# Altium schematic sheet ForEK2.SchDoc
size A3; SheetNumber: 1; SheetTotal: 1
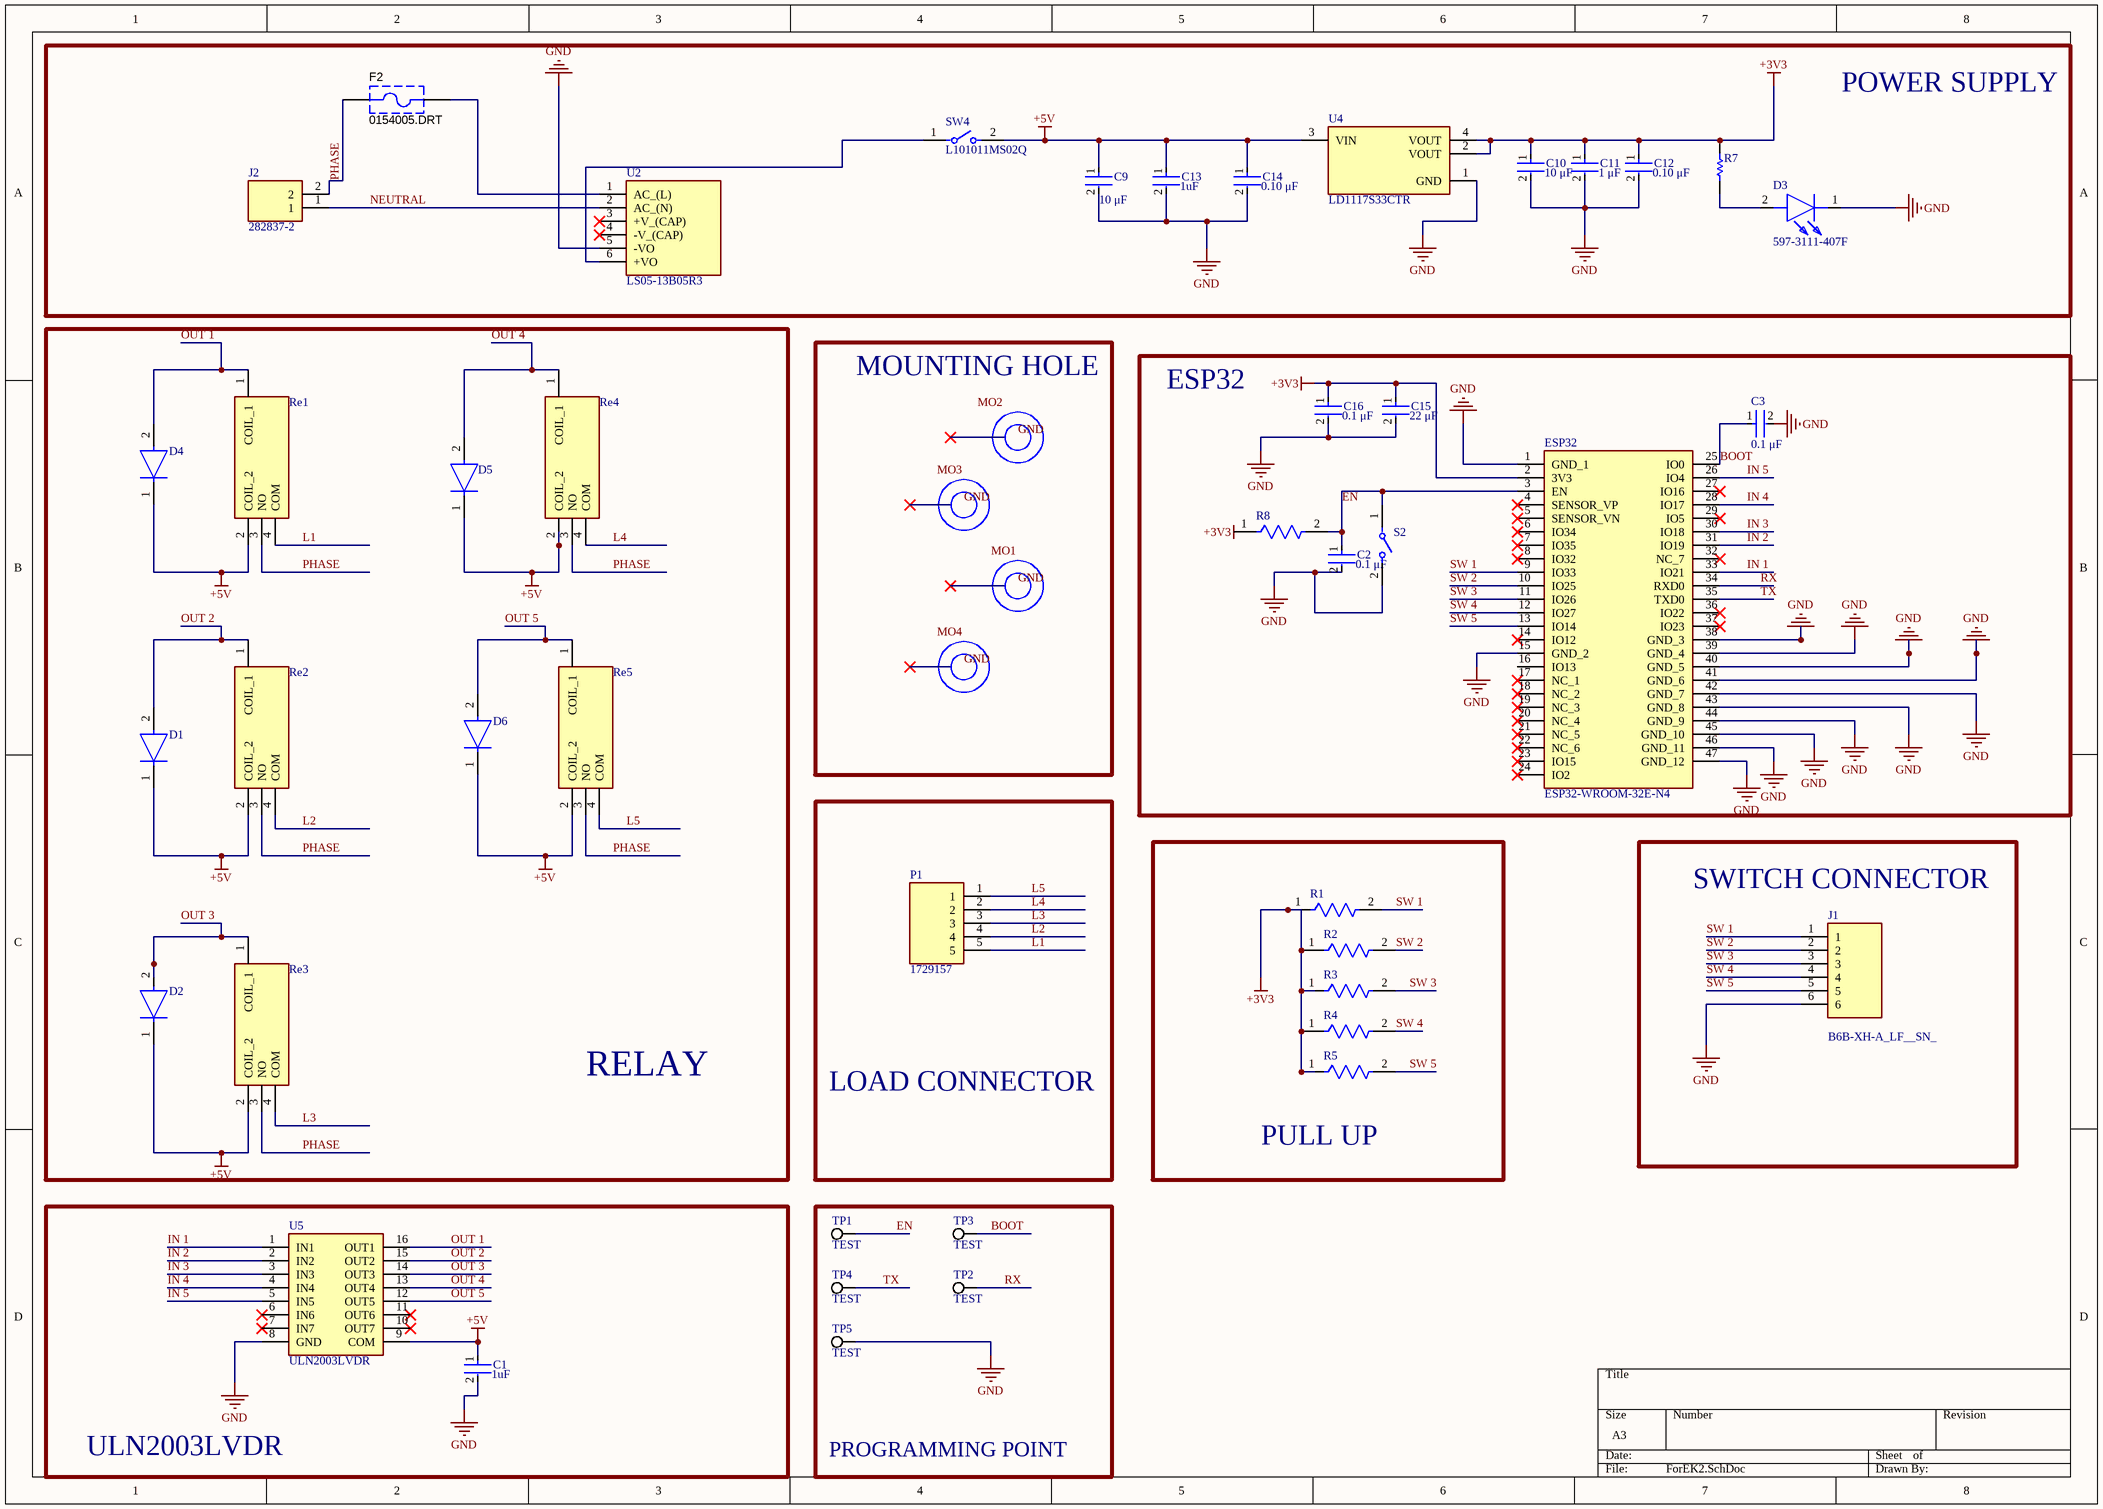
[diagram p0: ForEK2.SchDoc]

## Parts
C1  Capacitance: 1uF  [FP-C0402-BB-MFG]  (hidden comment: C0402C104K8PACTU)
C2  value 0.1 μF  [FP-C0402-BB-MFG]  (hidden comment: C0402C104K8PACTU)
C3  value 0.1 μF  [FP-C0402-BB-MFG]  (hidden comment: C0402C104K8PACTU)
C9  value 10 μF  [FP-C0402-BB-MFG]  (hidden comment: C0402C104K8PACTU)
C10  value 10 μF  [FP-C0402-BB-MFG]  (hidden comment: C0402C104K8PACTU)
C11  value 1 μF  [FP-C0402-BB-MFG]  (hidden comment: C0402C104K8PACTU)
C12  Capacitance: 0.10 μF  [FP-C0402-BB-MFG]  (hidden comment: C0402C104K8PACTU)
C13  Capacitance: 1uF  [FP-C0402-BB-MFG]  (hidden comment: C0402C104K8PACTU)
C14  value 0.10 μF  [FP-C0402-BB-MFG]  (hidden comment: C0402C104K8PACTU)
C15  value 22 μF  [FP-C0402-BB-MFG]  (hidden comment: C0402C104K8PACTU)
C16  value 0.1 μF  [FP-C0402-BB-MFG]  (hidden comment: C0402C104K8PACTU)
D1  1N4148  [FP-017AG-MFG]  (value not drawn)
D2  1N4148  [FP-017AG-MFG]  (value not drawn)
D3  597-3111-407F  [LEDC3015X150N]
D4  1N4148  [FP-017AG-MFG]  (value not drawn)
D5  1N4148  [FP-017AG-MFG]  (value not drawn)
D6  1N4148  [FP-017AG-MFG]  (value not drawn)
ESP32  ESP32-WROOM-32E-N4  [ESP32WROOM32EN4]
F2  0154005.DRT  [LFUS-154_V]
J1  B6B-XH-A_LF__SN_  [SHDR6W64P0X250_1X6_1740X575X700P]
J2  282837-2  [2828372]
P1  1729157  [1729157]
R1  CRCW040210K0JNED  [FP-CRCW0402-e3-IPC_B]  (value not drawn)
R2  CRCW040210K0JNED  [FP-CRCW0402-e3-IPC_B]  (value not drawn)
R3  CRCW040210K0JNED  [FP-CRCW0402-e3-IPC_B]  (value not drawn)
R4  CRCW040210K0JNED  [FP-CRCW0402-e3-IPC_B]  (value not drawn)
R5  CRCW040210K0JNED  [FP-CRCW0402-e3-IPC_B]  (value not drawn)
R7  ERJ-3EKF3300V  [RESC1608X55X30LL15T15]  (value not drawn)
R8  CRCW040210K0JNED  [FP-CRCW0402-e3-IPC_B]  (value not drawn)
Re1  HF46F-G_5-HS1T  [HF46FG5HS1T]  (value not drawn)
Re2  HF46F-G_5-HS1T  [HF46FG5HS1T]  (value not drawn)
Re3  HF46F-G_5-HS1T  [HF46FG5HS1T]  (value not drawn)
Re4  HF46F-G_5-HS1T  [HF46FG5HS1T]  (value not drawn)
Re5  HF46F-G_5-HS1T  [HF46FG5HS1T]  (value not drawn)
S2  L101011MS02Q  [FP-L101011MS02Q-MFG]  (value not drawn)
SW4  L101011MS02Q  [FP-L101011MS02Q-MFG]
TP1  TEST  [KSTN-5012_V]
TP2  TEST  [KSTN-5012_V]
TP3  TEST  [KSTN-5012_V]
TP4  TEST  [KSTN-5012_V]
TP5  TEST  [KSTN-5012_V]
U2  LS05-13B05R3  [LS0513B05R3]
U4  LD1117S33CTR  [FP-SOT-223-0046067_14-MFG]
U5  ULN2003LVDR  [SOIC127P600X175-16N]

## Blocks framed on the sheet
POWER SUPPLY: C9-C14 D3 F2 J2 R7 SW4 U2 U4
RELAY: D1 D2 D4-D6 Re1-Re5
ESP32: C2 C3 C15 C16 ESP32 R8 S2
LOAD CONNECTOR: P1
PULL UP: R1-R5
SWITCH CONNECTOR: J1
ULN2003LVDR: C1 U5
PROGRAMMING POINT: TP1-TP5

## Nets
+3V3: C10.1 C11.1 C12.1 C15.1 C16.1 ESP32.2(3V3) R1.1 R2.1 R3.1 R4.1 R5.1 R7.2 U4.2(VOUT) U4.4(VOUT)
+5V: C1.1 C9.1 C13.1 C14.1 D1.1(C) D2.1(C) D4.1(C) D5.1(C) D6.1(C) Re1.2(COIL_2) Re2.2(COIL_2) Re3.2(COIL_2) Re4.2(COIL_2) Re5.2(COIL_2) SW4.2 U4.3(VIN) U5.9(COM)
GND: C1.2 C2.2 C3.2 C9.2 C10.2 C11.2 C12.2 C13.2 C14.2 C15.2 C16.2 D3.1(K) ESP32.1(GND_1) ESP32.15(GND_2) ESP32.38(GND_3) ESP32.39(GND_4) ESP32.40(GND_5) ESP32.41(GND_6) ESP32.42(GND_7) ESP32.43(GND_8) ESP32.44(GND_9) ESP32.45(GND_10) ESP32.46(GND_11) ESP32.47(GND_12) J1.6 S2.2 TP5.1 U2.5(-VO) U4.1(GND) U5.8(GND)
BOOT: C3.1 ESP32.25(IO0) TP3.1
EN: C2.1 ESP32.3(EN) R8.2 S2.1 TP1.1
IN 1: ESP32.33(IO21) U5.1(IN1)
IN 2: ESP32.31(IO19) U5.2(IN2)
IN 3: ESP32.30(IO18) U5.3(IN3)
IN 4: ESP32.28(IO17) U5.4(IN4)
IN 5: ESP32.26(IO4) U5.5(IN5)
L1: P1.5 Re1.4(COM)
L2: P1.4 Re2.4(COM)
L3: P1.3 Re3.4(COM)
L4: P1.2 Re4.4(COM)
L5: P1.1 Re5.4(COM)
NEUTRAL: J2.1 U2.2(AC_(N))
OUT 1: D4.2(A) Re1.1(COIL_1) U5.16(OUT1)
OUT 2: D1.2(A) Re2.1(COIL_1) U5.15(OUT2)
OUT 3: D2.2(A) Re3.1(COIL_1) U5.14(OUT3)
OUT 4: D5.2(A) Re4.1(COIL_1) U5.13(OUT4)
OUT 5: D6.2(A) Re5.1(COIL_1) U5.12(OUT5)
PHASE: F2.1 J2.2 Re1.3(NO) Re2.3(NO) Re3.3(NO) Re4.3(NO) Re5.3(NO)
RX: ESP32.34(RXD0) TP2.1
SW 1: ESP32.9(IO33) J1.1 R1.2
SW 2: ESP32.10(IO25) J1.2 R2.2
SW 3: ESP32.11(IO26) J1.3 R3.2
SW 4: ESP32.12(IO27) J1.4 R4.2
SW 5: ESP32.13(IO14) J1.5 R5.2
TX: ESP32.35(TXD0) TP4.1
NetD3_2: D3.2(A) R7.1
NetF2_2: F2.2 U2.1(AC_(L))
NetSW4_1: SW4.1 U2.6(+VO)

Not connected (* = marked no-connect by the designer): ESP32 4(SENSOR_VP)* 5(SENSOR_VN)* 6(IO34)* 7(IO35)* 8(IO32)* 14(IO12)* 16(IO13) 17(NC_1)* 18(NC_2)* 19(NC_3)* 20(NC_4)* 21(NC_5)* 22(NC_6)* 23(IO15)* 24(IO2)* 27(IO16)* 29(IO5)* 32(NC_7)* 36(IO22)* 37(IO23)*; R8 1; U2 3(+V_(CAP))* 4(-V_(CAP))*; U5 6(IN6)* 7(IN7)* 10(OUT7)* 11(OUT6)*

## Notes on the sheet
- MOUNTING HOLE
- Labels drawn without touching a wire or pin: +3V3, GND, MO1, MO2, MO3, MO4

## Library data of the parts
C1 C13 = CMP-2008-02046-2: CAP CER 0.1UF 10V X5R 0402; Manufacturer: Kemet; Material: Ceramic; Temperature Coefficient: 15%; Tolerance: 0.1; Value: 1 μF; Package: C0402-BB; Temperature: -55°C to +125°C; ComponentLink2Description: Datasheet; Temperature Characteristic: X5R; Device Class L1: Passive Components; Height: 0.55mm; Lead Free: Yes; ComponentLink2URL: https://content.kemet.com/datasheets/KEM_C1002_X7R_SMD.pdf; Device Class L2: Capacitors; Temperature Range Low: -55°C; Temperature Range High: +125°C; RoHS: TRUE; Octopart: https://octopart.com/c0402c104k8pactu-kemet-140039; Automotive: No; Mouser Description: Capacitor 100 nF 10 VDC 0402; Category: Cap; Voltage Rating: 10 V; Digikey Description: CAP CER 0.1UF 10V X5R 0402; Ipc Land Pattern Name: CAPC10050X50; Device Class L3: Ceramic Capacitors; Manufacturer Part Number: C0402C104K8PACTU
C2 C3 C9-C11 C14-C16 = CMP-2008-02046-2: CAP CER 0.1UF 10V X5R 0402; Manufacturer: Kemet; Material: Ceramic; Temperature Coefficient: 15%; Tolerance: 0.1; Package: C0402-BB; Temperature: -55°C to +125°C; ComponentLink2Description: Datasheet; Temperature Characteristic: X5R; Device Class L1: Passive Components; Height: 0.55mm; Lead Free: Yes; ComponentLink2URL: https://content.kemet.com/datasheets/KEM_C1002_X7R_SMD.pdf; Device Class L2: Capacitors; Temperature Range Low: -55°C; Temperature Range High: +125°C; RoHS: TRUE; Octopart: https://octopart.com/c0402c104k8pactu-kemet-140039; Automotive: No; Mouser Description: Capacitor 100 nF 10 VDC 0402; Category: Cap; Voltage Rating: 10 V; Digikey Description: CAP CER 0.1UF 10V X5R 0402; Ipc Land Pattern Name: CAPC10050X50; Device Class L3: Ceramic Capacitors; Manufacturer Part Number: C0402C104K8PACTU
  C2 C3 C16: Capacitance: 0.1 μF
  C9 C10: Capacitance: 10 μF
  C11: Capacitance: 1 μF
  C14: Capacitance: 0.10 μF
  C15: Capacitance: 22 μF
C12 = CMP-2008-02046-2: CAP CER 0.1UF 10V X5R 0402; Manufacturer: Kemet; Material: Ceramic; Temperature Coefficient: 15%; Tolerance: 0.1; Value: 0.10 μF; Package: C0402-BB; Temperature: -55°C to +125°C; ComponentLink2Description: Datasheet; Temperature Characteristic: X5R; Device Class L1: Passive Components; Height: 0.55mm; Lead Free: Yes; ComponentLink2URL: https://content.kemet.com/datasheets/KEM_C1002_X7R_SMD.pdf; Device Class L2: Capacitors; Temperature Range Low: -55°C; Temperature Range High: +125°C; RoHS: TRUE; Octopart: https://octopart.com/c0402c104k8pactu-kemet-140039; Automotive: No; Mouser Description: Capacitor 100 nF 10 VDC 0402; Category: Cap; Voltage Rating: 10 V; Digikey Description: CAP CER 0.1UF 10V X5R 0402; Ipc Land Pattern Name: CAPC10050X50; Device Class L3: Ceramic Capacitors; Manufacturer Part Number: C0402C104K8PACTU
D1 D2 D4-D6 = CMP-07163-000046-1: DIODE GEN PURP 100V 200MA DO35; Forward Voltage: 1V; Max Power Dissipation: 500mW; Max Reverse Current: 5uA; Forward Current: 300mA; Current: 4A; Reverse Recovery Time: 4ns; Element Configuration: Single; Outside Diameter: 1.85mm; Capacitance: 4pF; Polarity: Standard; Max Forward Surge Current (Ifsm): 1A; Reverse Voltage: 100V; Output Current: 200mA; Average Rectified Current: 200mA; Diameter: 1.91mm; Max Repetitive Reverse Voltage (Vrrm): 100V; Current Rating: 200mA; Case/Package: DO-35; Lead Free: Lead Free; Number of Pins: 2; Recovery Time: 4ns; Packaging: Bulk; Contact Plating: Tin; Voltage: 100V; Mount: Through Hole; Max Surge Current: 4A; Package Quantity: 2000; Width: 1.91mm; Max Reverse Voltage (DC): 100V; Length: 4.56mm; Radiation Hardening: No; Power Dissipation: 500mW; Voltage Rating (DC): 100V; Peak Non-Repetitive Surge Current: 4A; REACH SVHC: No SVHC; Height: 4.56mm; Max Operating Temperature: 175°C; Series: -; Weight: 0.01lb; Min Operating Temperature: -65°C
D3 = 597-3111-407F: LED; Manufacturer_Name: Dialight; Datasheet Link: https://datasheet.datasheetarchive.com/originals/distributors/Datasheets-DGA13/1153722.pdf; Height: 1.5mm; Manufacturer_Part_Number: 597-3111-407F; Mouser Part Number: 645-597-3111-407F; Mouser Price/Stock: https://www.mouser.co.uk/ProductDetail/Dialight/597-3111-407F?qs=DVhSRDYZfLqO0KXLkTIRsA%3D%3D; Arrow Part Number: 597-3111-407F; Arrow Price/Stock: https://www.arrow.com/en/products/597-3111-407f/dialight?utm_currency=USD&region=nac
ESP32 = ESP32-WROOM-32E-N4: Integrated Circuit; Manufacturer_Name: Espressif Systems; Datasheet Link: https://www.espressif.com/sites/default/files/documentation/esp32-wroom-32e_esp32-wroom-32ue_datasheet_en.pdf; Height: 3.25mm; Manufacturer_Part_Number: ESP32-WROOM-32E-N4; Mouser Part Number: 356-ESP32WRM32E132PH; Mouser Price/Stock: https://www.mouser.co.uk/ProductDetail/Espressif-Systems/ESP32-WROOM-32E-N4?qs=Li%252BoUPsLEnsPzTWsi%252BRMgQ%3D%3D
F2 = CMP-2000-07571-1: Fuse and Holder Combination, 125 V, 5 A, -55 to 125 degC, 2-Pin SMD, RoHS, Tape and Reel; Manufacturer: Littelfuse; Voltage Rating (DC): 125V; DC Cold Resistance: 13.6mOhm; Case\/Package: SMD/SMT; Body Material: Thermoplastic; Fuse Type: BoardMount(CartridgeStyleExcluded); Fuse Current: 5A; Power Dissipation: 125W; Colour: White; Approvals: PSE; Number of Pins: 2; Depth: 5.03mm; Radiation Hardening: No; Working Voltage: 125V; Terminal Material: Copper; Voltage Rating: 125V; REACH SVHC: Unknown; Flammability Rating: UL94V-0; Datasheet URL: http://www.littelfuse.com/~/media/electronics/datasheets/fuses/littelfuse_fuse_154_154t_154l_154tl_datasheet.pdf.pdf; Manufacturer URL: http://www.littelfuse.com/; Datasheet Version: 06/2017; Lead Free: LeadFree; RoHSCompliant: True; Mounting Technology: SurfaceMount; Package Reference: 154; Height: 3.81mm; Termination: SMD/SMT; Width: 5.03mm; Length: 9.73mm; Mount: Holder; Min Operating Temperature: -55degC; Max Operating Temperature: 125degC; Package Quantity: 1500; Package Description: 2-Pin Surface Mount Device, Body 9.73 x 5.03 mm; Current Rating: 5A; Packaging: TapeandReel; Voltage Rating (AC): 125V
J1 = B6B-XH-A_LF__SN_: Connector; Manufacturer_Name: JST (JAPAN SOLDERLESS TERMINALS); Manufacturer_Part_Number: B6B-XH-A(LF)(SN); Datasheet Link: https://datasheet.lcsc.com/szlcsc/JST-Sales-America-B6B-XH-A-LF-SN_C144397.pdf; Height: 7mm; Mouser Part Number: 306-B6BXHALFSN; Mouser Price/Stock: https://www.mouser.co.uk/ProductDetail/JST-Commercial/B6B-XH-ALFSN?qs=cdbOS8ANM9AKmMmofXbwlw%3D%3D; Arrow Part Number: B6B-XH-A(LF)(SN); Arrow Price/Stock: https://www.arrow.com/en/products/b6b-xh-a-lf-sn/jst-manufacturing?utm_currency=USD&region=europe
J2 = 282837-2: Connector; Manufacturer_Name: TE Connectivity; Datasheet Link: https://www.te.com/commerce/DocumentDelivery/DDEController?Action=srchrtrv&DocNm=1-1773458-1_EURO_STYLE_QRG&DocType=Data%20Sheet&DocLang=English&PartCntxt=282837-2&DocFormat=pdf; Height: 10.3mm; Manufacturer_Part_Number: 282837-2; Mouser Part Number: 571-2828372; Mouser Price/Stock: https://www.mouser.co.uk/ProductDetail/TE-Connectivity/282837-2?qs=A%252Bip%252BNCYi6O2H0NGWOeAxg%3D%3D; Arrow Part Number: 282837-2; Arrow Price/Stock: https://www.arrow.com/en/products/282837-2/te-connectivity?utm_currency=USD&region=europe
P1 = 1729157: Connector; Manufacturer_Name: Phoenix Contact; Datasheet Link: http://www.phoenixcontact.com/de/produkte/1729157/pdf; Height: 10.15mm; Manufacturer_Part_Number: 1729157; Mouser Part Number: 651-1729157; Mouser Price/Stock: https://www.mouser.co.uk/ProductDetail/Phoenix-Contact/1729157?qs=GFUSqQMLmmm7NDLceAVXHA%3D%3D; Arrow Part Number: 1729157; Arrow Price/Stock: https://www.arrow.com/en/products/1729157/phoenix-contact?region=nac
R1-R5 R8 = CMP-2002-08136-3: RES Thick Film, 10kΩ, 5%, 0.063W, 200ppm/°C, 0402; Voltage Rating: 50V; Power Rating: 63mW; Resistance: 10kR; Military Standard: Not; Packaging: Tape and Reel; Case Code (Imperial): 0402; Min Operating Temperature: -55°C; Case Code (Metric): 1005; Case/Package: 0402; Temperature Coefficient: 200ppm/°C; Termination: SMD/SMT; Composition: Thick Film; Depth: 0.5mm; Number of Terminations: 2; Contact Plating: Tin; Height: 0.016inch; Width: 0.5mm; Max Operating Temperature: 155°C; Features: Automotive AEC-Q200; Length: 1mm; Radiation Hardening: No; Max Power Dissipation: 63mW; Mount: Surface Mount; Tolerance: 5%; Package Quantity: 1; Weight: 2.3E-05oz
R7 = CMP-2000-00435-2: Chip Resistor, 330 Ohm, +/- 1%, 0.1 W, -55 to 155 degC, 0603 (1608 Metric), RoHS, Tape and Reel; Gender: Male; Mating Cycles: 10000; Current Rating: 500 mA; Voltage Rating: 10 V; REACH SVHC: No SVHC; PackageDescription: 2-Pin Surface Mount Device, Body 1.6 x 0.85 mm; Contact Finish: Gold; Pins: 8; ComponentLink1Description: Manufacturer URL; Packaging: Tape and Reel; Max Operating Temperature: 85 degC; Contact Material: Copper; Height: 1.45 mm; Width: 1.45 mm; DatasheetVersion: Apr-15; Package Quantity: 1500; Contact Plating: Gold; PackageReference: 0603; Mount: Surface Mount; Lead Pitch: 1.1 mm; Min Operating Temperature: -25 degC; ComponentLink1URL: http://www.panasonic.com/; ComponentLink2URL: http://industrial.panasonic.com/cdbs/www-data/pdf/RDA0000/AOA0000C86.pdf; Length: 13.7 mm; ComponentLink2Description: Datasheet; RoHSCompliant: true
Re1-Re5 = HF46F-G_5-HS1T: Relay or Contactor; Manufacturer_Name: Hongfa; Manufacturer_Part_Number: HF46F-G/5-HS1T; Datasheet Link: https://source.hongfa.com//Api/DownloadPdf/434; Height: 15.6mm
S2 SW4 = CMP-10038-000020-1: SWITCH SLIDE SPST 4A 125V; Actuator Length: 5.08mm; Actuator Type: Standard; Contact Current Rating: 2A; Electrical Life: 10000Cycles; Switch Function: On-Off; Voltage Rating (DC): 28V; Actuator Color: Black; Actuator Material: Nylon; Switch Travel: 3.81mm; Max Voltage Rating (AC): 250V; Max Current Rating: 4A; Contact Plating: Silver; Throw Configuration: SPST; Depth: 10.8mm; Package Quantity: 1; Length: 19.1mm; Current Rating: 4A; Max Operating Temperature: 65°C; Orientation: Straight; Radiation Hardening: No; Termination: PC Pins; Max Voltage Rating (DC): 125V; Series: L; Min Operating Temperature: -30°C; Contact Material: Copper; Lead Free: Lead Free; Mount: Through Hole; RoHS Compliant: Yes; Voltage Rating (AC): 125V; Packaging: Bulk; Housing Material: Nylon
TP1-TP5 = CMP-1672-00004-4: Test Point, White, Through Hole, RoHS, Bulk; Manufacturer: Keystone; DatasheetVersion: Rev. F, 12/2013; ComponentLink1URL: http://www.keyelco.com/; PackageReference: 5012; RoHSCompliant: true; ComponentLink2Description: Datasheet; Colour: White; Contact Material: Bronze; PackageDescription: 1-Pin Through Hole Device, Dia 3.17 mm; Mounting Technology: Through Hole; Mount: Through Hole; Package Quantity: 100; ComponentLink1Description: Manufacturer URL; Pins: 1; Height: 8.12 mm; Packaging: Bulk; REACH SVHC: No SVHC; Contact Plating: Silver; Length: 11.3 mm; ComponentLink2URL: http://www.keyelco.com/product-pdf.cfm?p=1321
U2 = LS05-13B05R3: Power Supply; Manufacturer_Name: Morunsun; Datasheet Link: https://www.mornsun-power.com/html/pdf/LS05-13B05R3.html; Height: 15.73mm; Manufacturer_Part_Number: LS05-13B05R3
U4 = CMP-0244-00307-2: IC REG LINEAR 3.3V 800MA SOT223; Input Bias Current: 5mA; Output Voltage Accuracy: 1%; Dropout Voltage: 1.1V; Power Dissipation: 12W; Polarity: Positive; Min Input Voltage: 5.3V; Quiescent Current: 10mA; Max Output Current: 1.3A; Output Current: 950mA; Number of Regulators: 1; Max Supply Voltage: 15V; Output Type: Fixed; Output Voltage: 3.3V; Number of Terminals: 4; Min Supply Voltage: 3.3V; Termination: SMD/SMT; Mount: Surface Mount; Max Power Dissipation: 12W; Case/Package: SOT-223; Lead Free: Lead Free; Height: 1.8mm; REACH SVHC: No SVHC; Radiation Hardening: No; Width: 3.5mm; Length: 6.5mm; Packaging: Tape and Reel; Max Input Voltage: 15V; Accuracy: 1%; Weight: 0.01lb; Contact Plating: Tin; Max Operating Temperature: 125°C; Number of Pins: 4; Max Output Voltage: 3.3V; Min Operating Temperature: -40°C; Nominal Output Voltage: 3.3V; Package Quantity: 1; Min Output Voltage: 3.3V; Number of Outputs: 1
U5 = ULN2003LVDR: Integrated Circuit; Manufacturer_Name: Texas Instruments; Datasheet Link: http://www.ti.com/lit/ds/symlink/uln2003lv.pdf; Height: 1.75mm; Manufacturer_Part_Number: ULN2003LVDR; Mouser Part Number: 595-ULN2003LVDR; Mouser Price/Stock: https://www.mouser.co.uk/ProductDetail/Texas-Instruments/ULN2003LVDR?qs=ACPZU2kmEKPLtcExeyaSSQ%3D%3D; Arrow Part Number: ULN2003LVDR; Arrow Price/Stock: https://www.arrow.com/en/products/uln2003lvdr/texas-instruments?region=nac